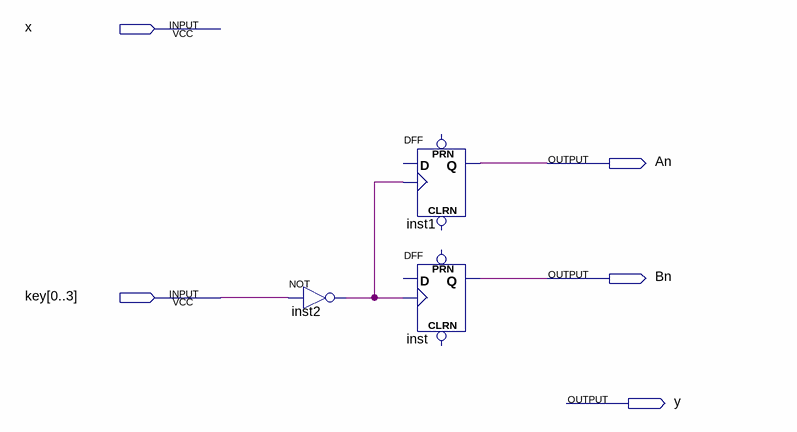
[diagram p0: schematic sheet]
// Quartus schematic FPGA_Sequential.bdf as structural Verilog: 3 symbols, 5 pins
module FPGA_Sequential (
  input  x,
  input  [0:3] key,
  output An,
  output Bn,
  output y
);

  wire inst2_out, undriven;

  not inst2 (inst2_out, undriven);
  DFF inst1 (.CLK(inst2_out), .Q(An));  // open: CLRN, D, PRN
  DFF inst (.CLK(inst2_out), .Q(Bn));  // open: CLRN, D, PRN
endmodule
